# EAGLE design ponteH (EAGLE 7.7.0)
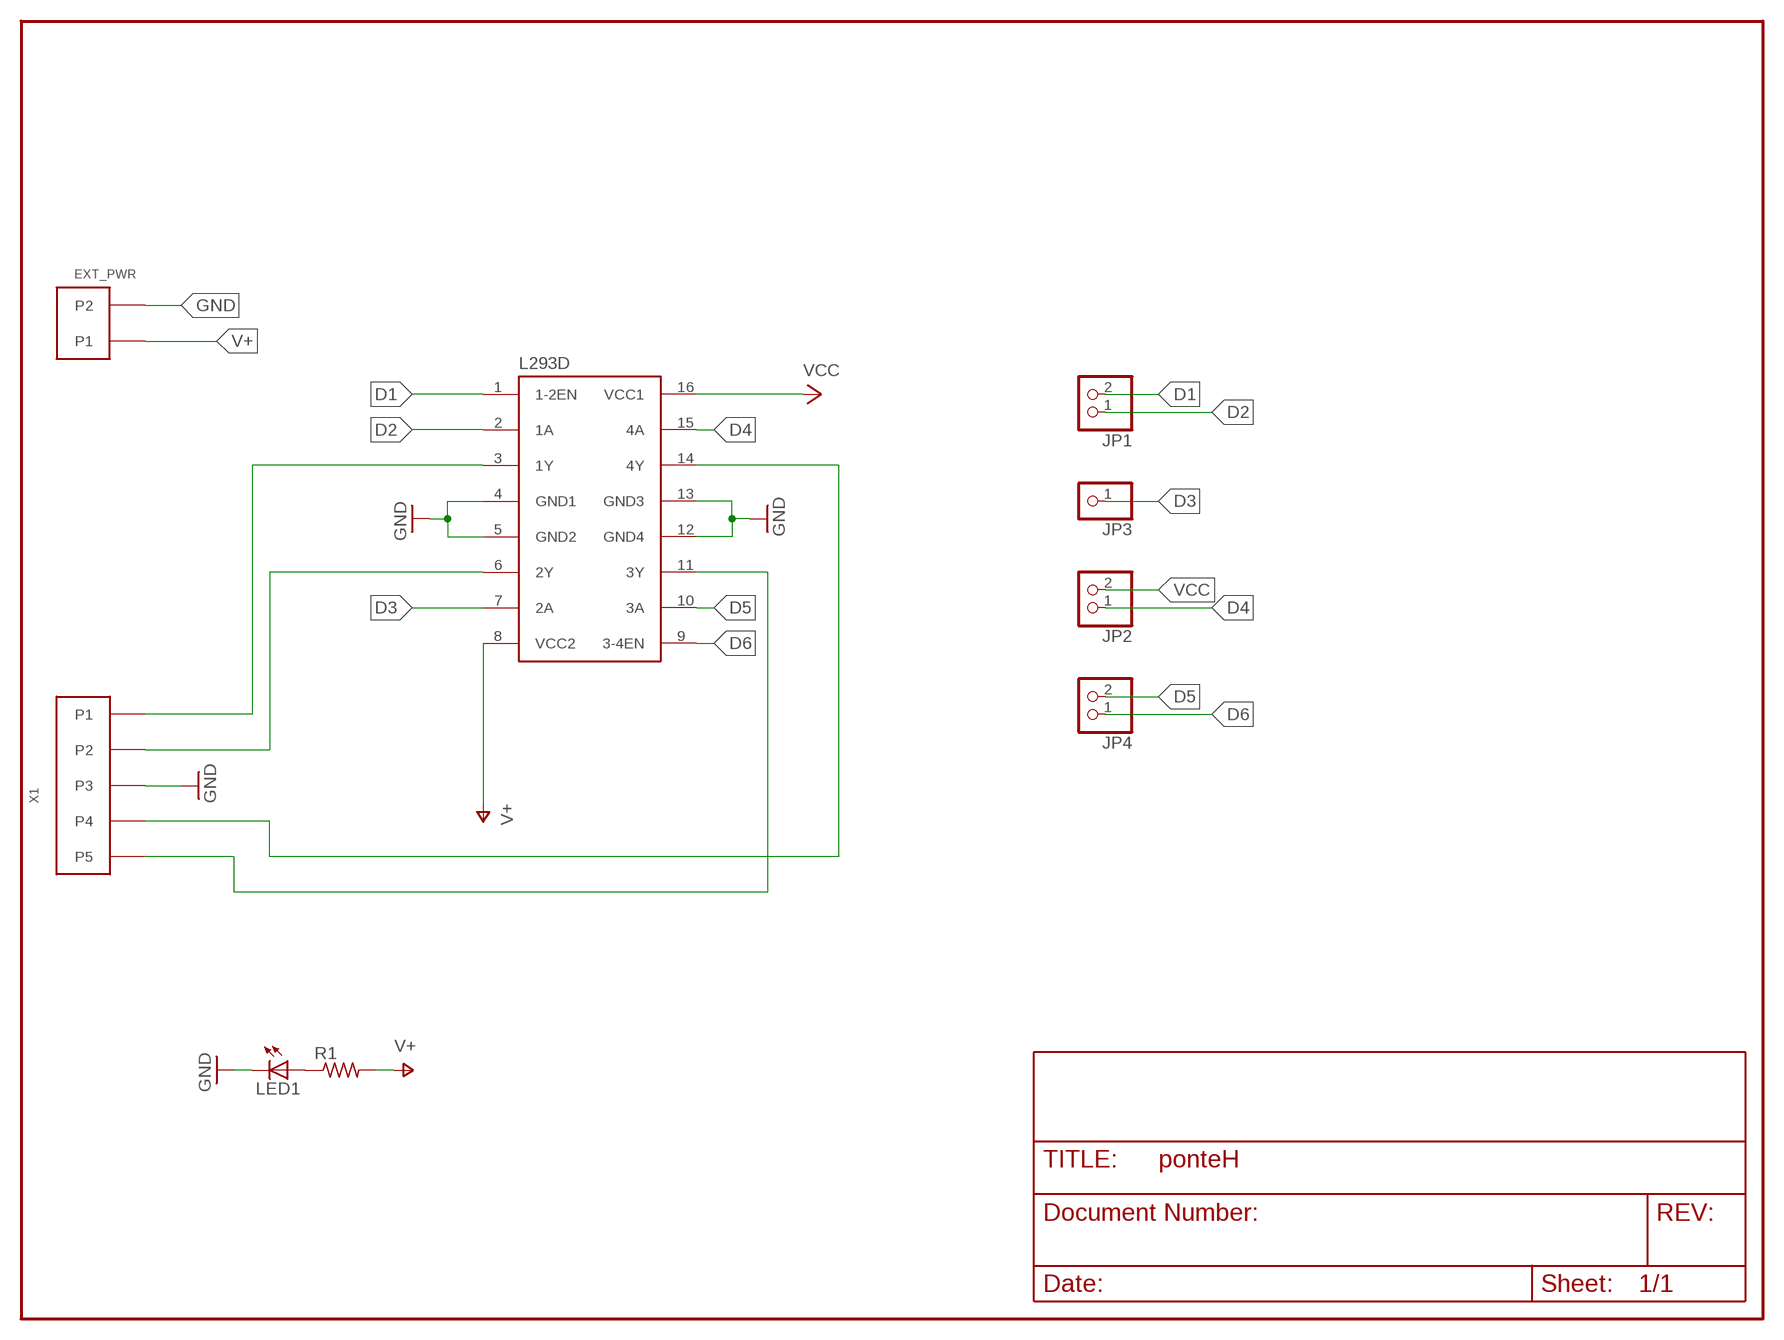
[diagram p0: schematic, sheet 1]

## Parts
EXT_PWR  PINHEAD  [TERMBLOCK508]
JP1  PINHD-1X2  [1X02]
JP2  PINHD-1X2  [1X02]
JP3  PINHD-1X1  [1X01]
JP4  PINHD-1X2  [1X02]
L293D  L293E  [DIL16]
LED1  LED3MM  [LED3MM]
R1  R-US_0207/10  [0207/10]
X1  TERM5  [TERM1X5]

## Nets
D1: JP1.2 L293D.1(1-2EN)
D2: JP1.1 L293D.2(1A)
D3: JP3.1 L293D.7(2A)
D4: JP2.1 L293D.15(4A)
D5: JP4.2 L293D.10(3A)
D6: JP4.1 L293D.9(3-4EN)
GND [power]: EXT_PWR.P$4(P2) L293D.4(GND1) L293D.5(GND2) L293D.12(GND4) L293D.13(GND3) LED1.K(C) X1.P3
N$1: L293D.3(1Y) X1.P1
N$31: L293D.6(2Y) X1.P2
N$32: L293D.11(3Y) X1.P5
N$33: L293D.14(4Y) X1.P4
N$35: LED1.A R1.1
V+: EXT_PWR.P$3(P1) L293D.8(VCC2) R1.2
VCC: JP2.2 L293D.16(VCC1)

## Library data of the parts
EXT_PWR = mshield:PINHEAD
JP1 JP2 JP4 = pinhead:PINHD-1X2: PIN HEADER
JP3 = pinhead:PINHD-1X1: PIN HEADER
L293D = texas:L293E: TI DEVICE
LED1 = minimidi:LED: LED OSRAM: - CHIPLED LG R971, LG N971, LY N971, LG Q971, LY Q971, LO R971, LY R971 LH N974, LH R974 LS Q976, LO Q976, LY Q976 LO Q996 - Hyper CHIPLED LW Q18S LB Q993, LB Q99A, LB R99A - SideLED LS A670, LO A670, LY A670, LG A670, LP A670 LB A673, LV A673, LT A673, LW A673 LH A674 LY A675 LS A676, LA A676, LO A676, LY A676, LW A676 LS A679, LY A679, LG A679 - Hyper Micro SIDELED® LS Y876, LA Y876, LO Y876, LY Y876 LT Y87S - SmartLED LW L88C, LW L88S LB L89C, LB L89S, LG L890 LS L89K, LO L89K, LY L89K LS L896, LA L896, LO L896, LY L896 - TOPLED LS T670, LO T670, LY T670, LG T670, LP T670 LSG T670, LSP T670, LSY T670, LOP T670, LYG T670 LG T671, LOG T671, LSG T671 LB T673, LV T673, LT T673, LW T673 LH T674 LS T676, LA T676, LO T676, LY T676, LB T676, LH T676, LSB T676, LW T676 LB T67C, LV T67C, LT T67C, LS T67K, LO T67K, LY T67K, LW E67C LS E67B, LA E67B, LO E67B, LY E67B, LB E67C, LV E67C, LT E67C LW T67C LS T679, LY T679, LG T679 LS T770, LO T770, LY T770, LG T770, LP T770 LB T773, LV T773, LT T773, LW T773 LH T774 LS E675, LA E675, LY E675, LS T675 LS T776, LA T776, LO T776, LY T776, LB T776 LHGB T686 LT T68C, LB T68C - Hyper Mini TOPLED® LB M676 - Mini TOPLED Santana® LG M470 LS M47K, LO M47K, LY M47K Source: http://www.osram.convergy.de/
R1 = rcl-ez:R-US_: RESISTOR, American symbol
X1 = mshield:TERM5

## Net classes
1 power: width 0.61 mm

## Board
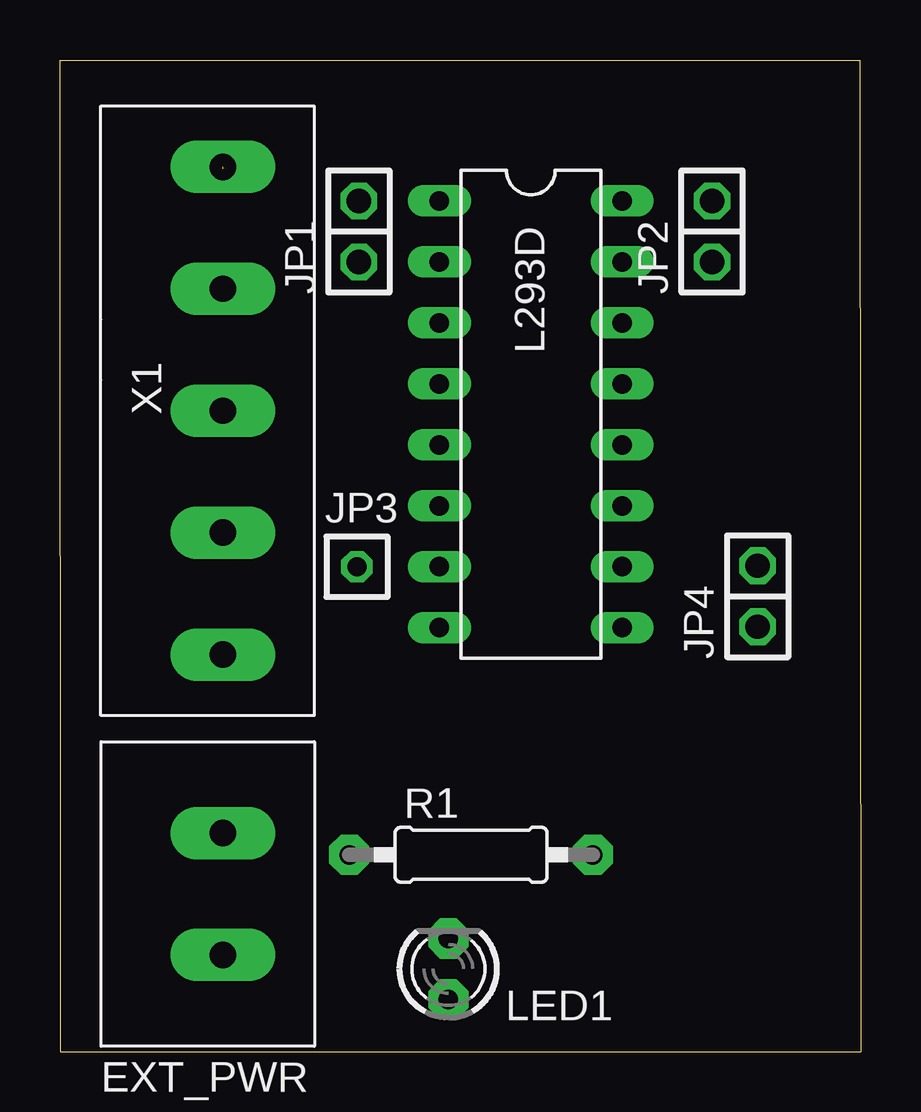
[diagram p1: board, top side]
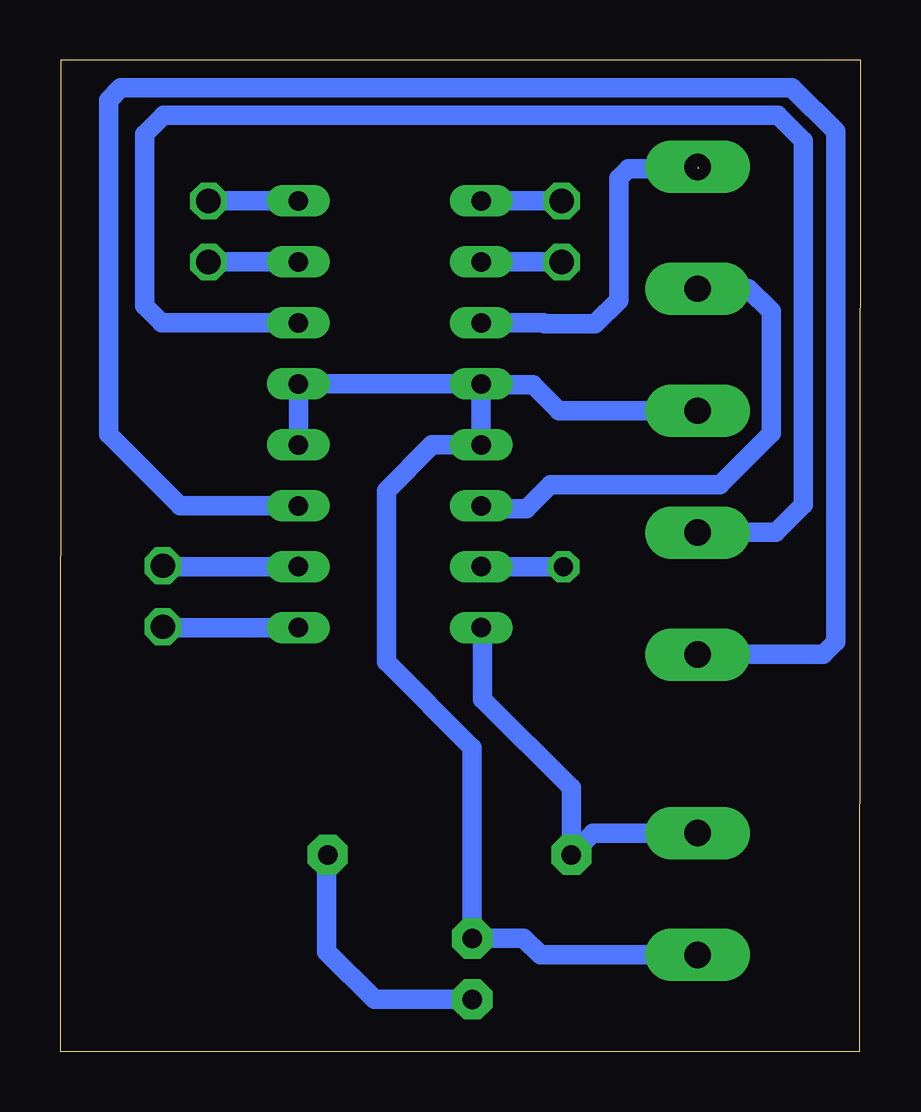
[diagram p2: board, bottom side, seen from below]

Size 33.38 x 41.31 mm. Coordinates in mm from the lower left corner, seen from the top.
Outline: 0.04,0 0,41.31 33.34,41.31 33.38,0 0.04,0
Copper layers (1*16): Top 0.035mm / dielectric 1.5mm / Bottom 0.035mm
Design rules "default": minimum track width 16mil, minimum drill 19mil, track to track 12mil, track to pad 12mil, pad to pad 12mil, via to via 12mil, smd to smd 0mil, copper to edge 10mil, drill to drill 8mil, minimum pad ring 10mil, minimum via ring 8mil, stop-mask expansion 4mil, vias tented up to drill 0mil, thermal gap 10mil

### Footprints (pad centres in the part's own frame; a part is rotated, then mirrored left to right if it is on the bottom)
TERMBLOCK508 = drill 1.1 pad 2.184 long: P$3 -2.54,0; P$4 2.54,0
1X02 = drill 1.016 octagon: 1 -1.27,0; 2 1.27,0
1X01 = drill 0.8 octagon: 1 0,0
DIL16 = drill 0.813 long: 1 -8.89,-3.81; 2 -6.35,-3.81; 3 -3.81,-3.81; 4 -1.27,-3.81; 5 1.27,-3.81; 6 3.81,-3.81; 7 6.35,-3.81; 8 8.89,-3.81; 9 8.89,3.81; 10 6.35,3.81; 11 3.81,3.81; 12 1.27,3.81; 13 -1.27,3.81; 14 -3.81,3.81; 15 -6.35,3.81; 16 -8.89,3.81
LED3MM = drill 0.813 pad 1.676 octagon: A -1.27,0; K 1.27,0
0207/10 = drill 0.813 pad 1.676 octagon: 1 -5.08,0; 2 5.08,0
TERM1X5 = drill 1.1 pad 2.184 long: P1 -10.16,0; P2 -5.08,0; P3 0,0; P4 5.08,0; P5 10.16,0

### Placement (x,y rotation side)
EXT_PWR  6.79,6.56 270 top
JP1  12.46,34.17 90 top
JP2  27.19,34.17 90 top
JP3  12.38,20.2 0 top
JP4  29.09,18.97 90 top
L293D  19.63,26.55 270 top
LED1  16.19,3.44 90 top
R1  17.14,8.2 180 top
X1  6.79,26.7 270 top

### Tracks (layer width: path | path; a pad name or v marks a point on that pad's centre or on a via)
D1
  Bottom 0.813: JP1.2 L293D.1
D2
  Bottom 0.813: JP1.1 L293D.2
D3
  Bottom 0.813: JP3.1 L293D.7
D4
  Bottom 0.813: L293D.15 JP2.1
D5
  Bottom 0.813: L293D.10 29.05,20.2 JP4.2
D6
  Bottom 0.813: L293D.9 29.05,17.66 JP4.1
GND
  Bottom 0.813: X1.P3 12.57,26.7 13.65,27.78 15.78,27.78 L293D.4 | L293D.4 L293D.5 17.86,25.28 19.76,23.38 19.76,16.23 16.19,12.66 LED1.K 16.18,4.72 14.05,4.72 13.35,4.02 EXT_PWR.P$4 | L293D.4 L293D.13 L293D.12
N$1  (1 unrouted)
  Bottom 0.813: L293D.3 13.22,30.36 13.18,30.32 11.07,30.32 10.08,31.31 10.08,36.39 9.68,36.79 6.79,36.79
N$31
  Bottom 0.813: X1.P2 4.68,31.78 3.73,30.84 3.73,25.76 5.87,23.61 12.94,23.61 13.93,22.62 15.7,22.62 L293D.6
N$32
  Bottom 0.813: L293D.11 28.38,22.74 31.35,25.72 31.35,39.65 30.84,40.16 2.86,40.16 1.03,38.34 1.03,17.07 1.55,16.55 X1.P5
N$33
  Bottom 0.813: L293D.14 29.13,30.36 29.84,31.07 29.84,38.22 29.05,39.01 3.45,39.01 2.38,37.94 2.38,22.78 3.53,21.63 X1.P4
N$35
  Bottom 0.813: LED1.A 20.27,2.17 22.26,4.17 22.26,8.15 R1.1
V+
  Bottom 0.813: L293D.8 15.76,17.6 15.76,14.68 12.06,10.99 R1.2 11.15,9.1 EXT_PWR.P$3
VCC
  Bottom 0.813: L293D.16 JP2.2